# EAGLE design driver (EAGLE 6.4)

## Sheet 1 of 2
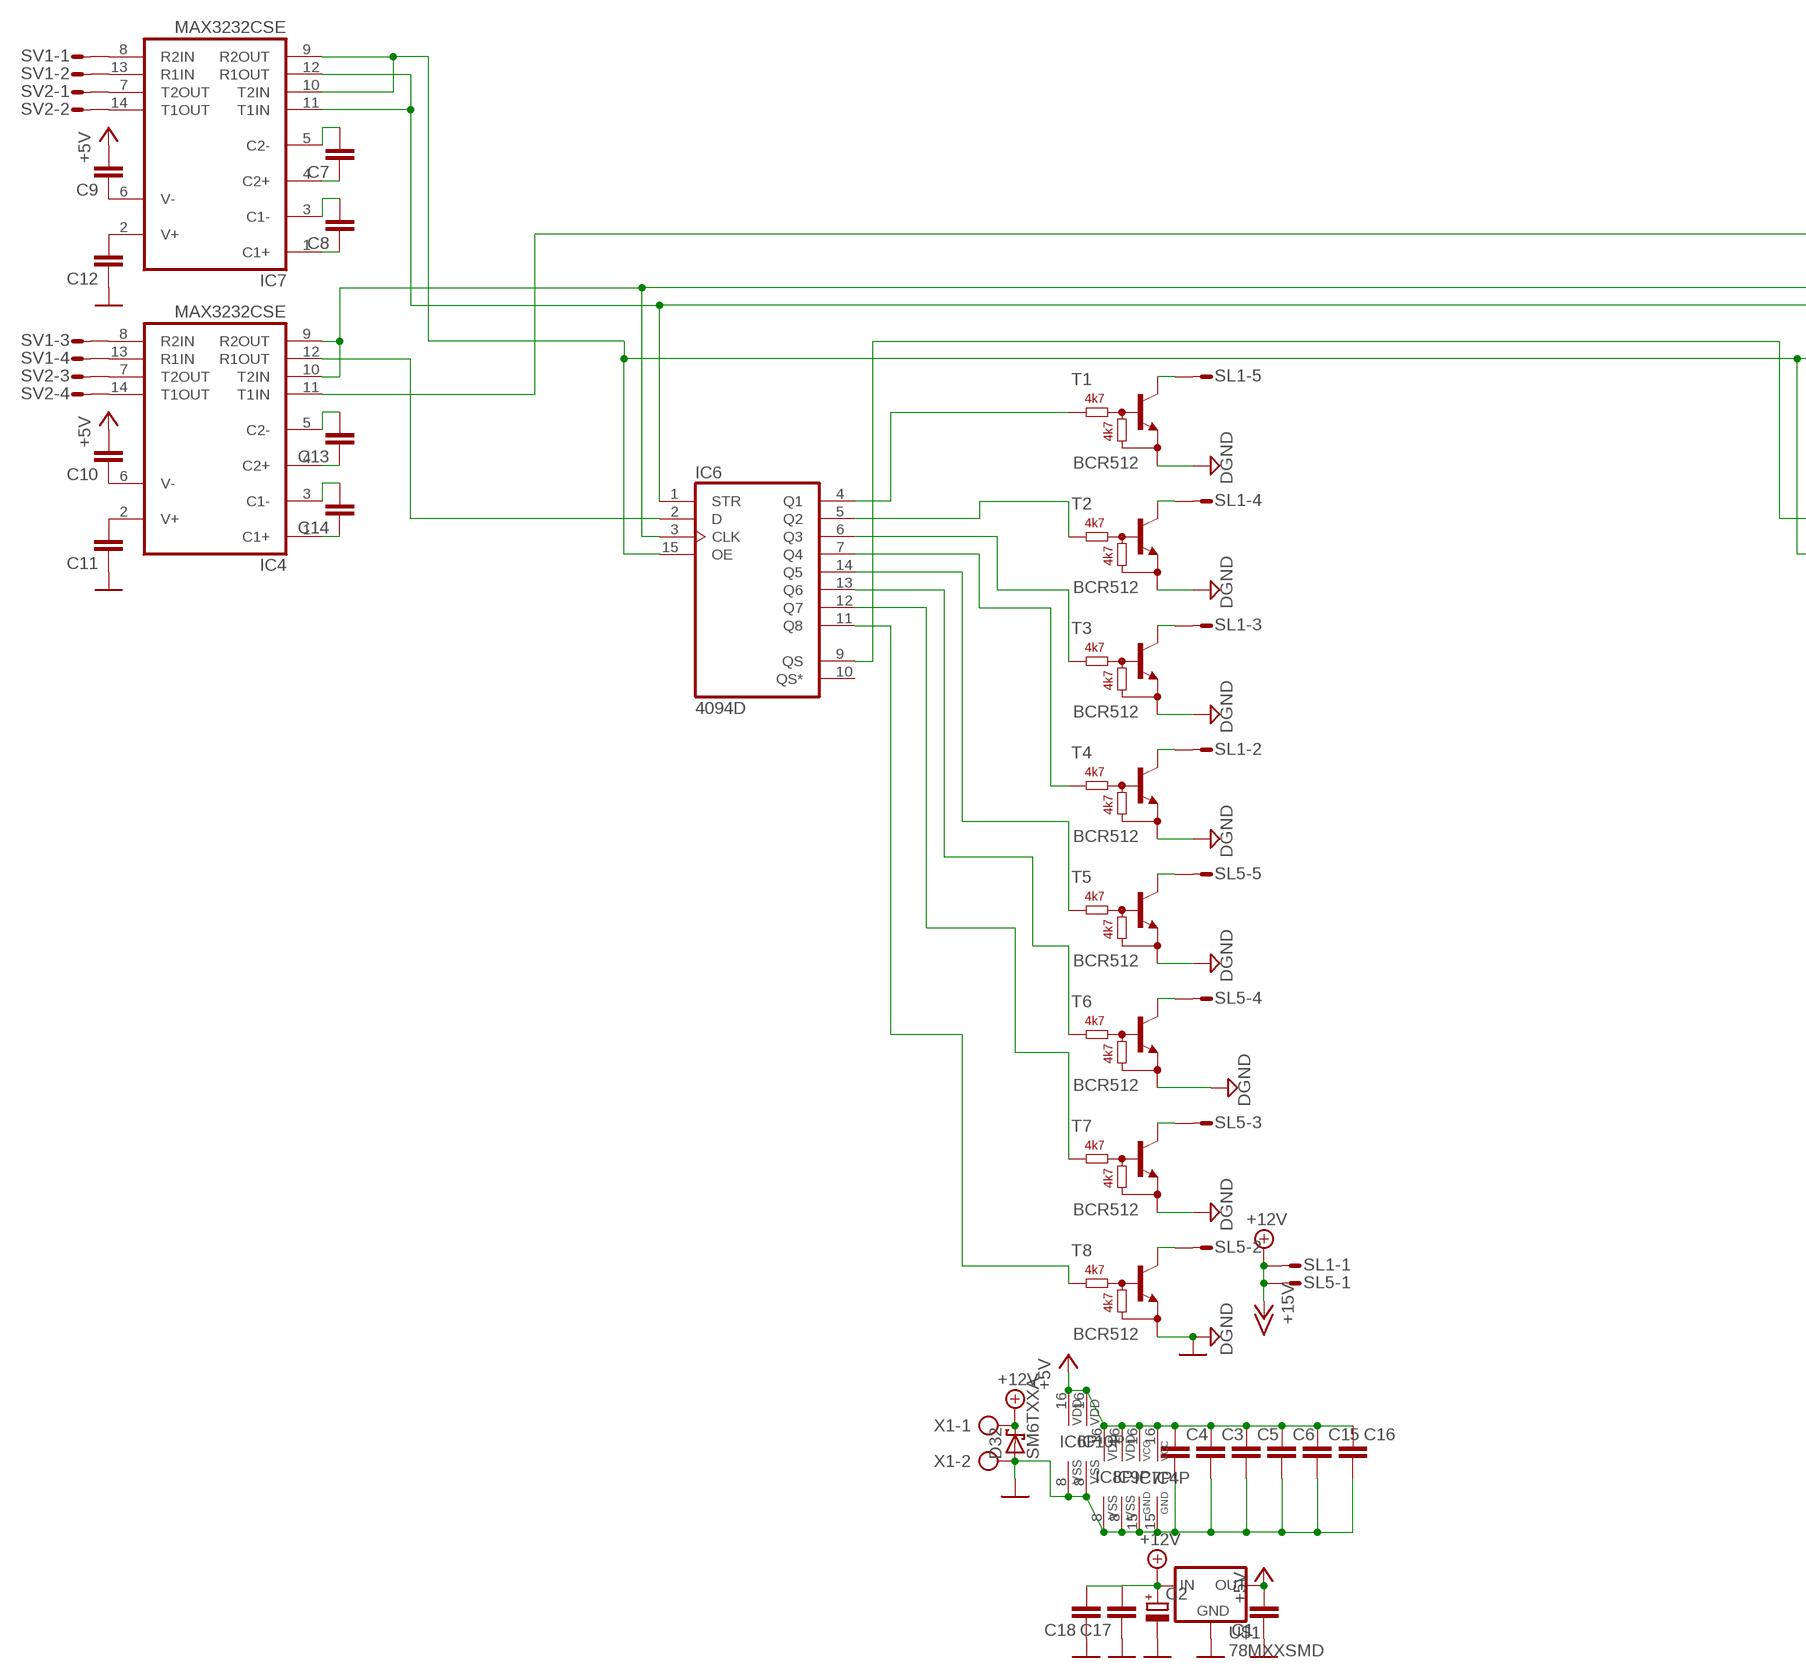
[diagram p0: schematic, sheet 1, part 1 of 2]
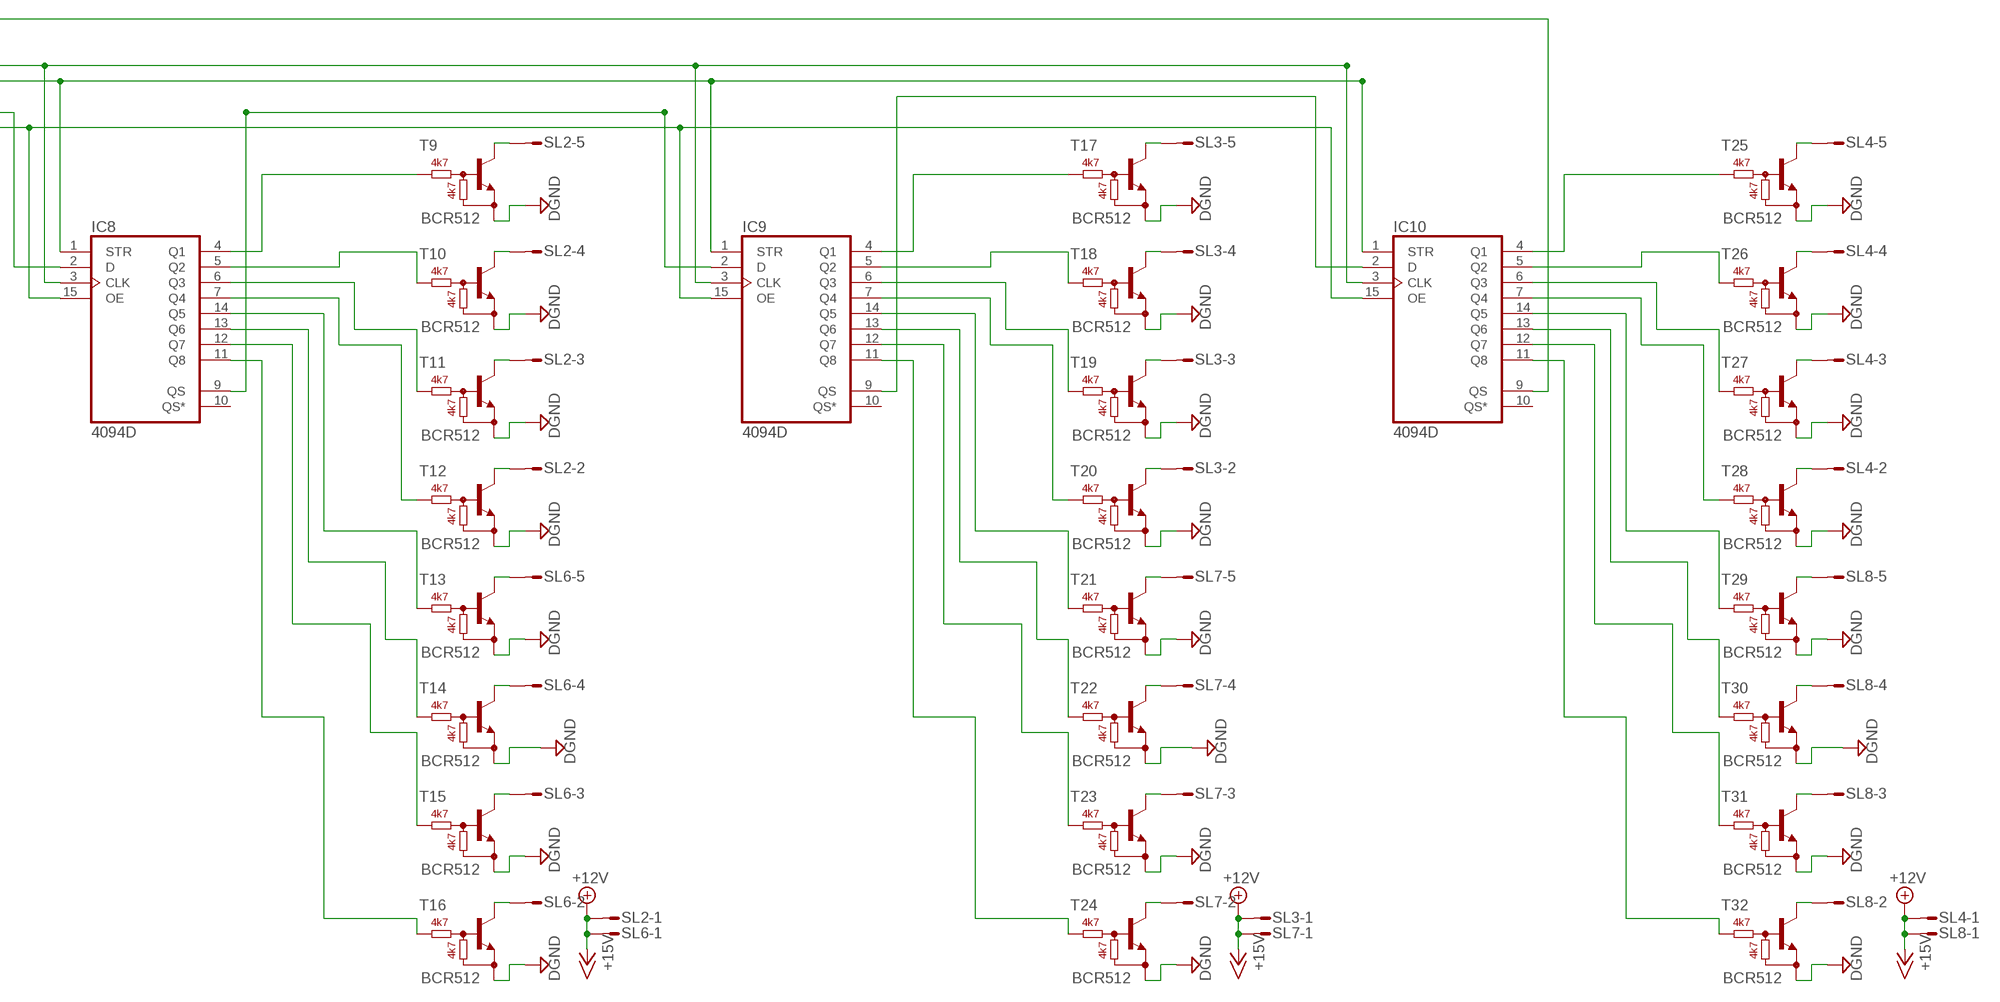
[diagram p1: schematic, sheet 1, part 2 of 2]

### Parts
C1  C-EUC0603  [C0603]
C2  CPOL-EUSMCD  [SMC_D]
C3  C-EUC0603  [C0603]
C4  C-EUC0603  [C0603]
C5  C-EUC0603  [C0603]
C6  C-EUC0603  [C0603]
C7  C-EUC0603  [C0603]
C8  C-EUC0603  [C0603]
C9  C-EUC0603  [C0603]
C10  C-EUC0603  [C0603]
C11  C-EUC0603  [C0603]
C12  C-EUC0603  [C0603]
C13  C-EUC0603  [C0603]
C14  C-EUC0603  [C0603]
C15  C-EUC0603  [C0603]
C16  C-EUC0603  [C0603]
C17  C-EUC0603  [C0603]
C18  C-EUC0603  [C0603]
D32  SM6TXXA  [SMB]
IC4  MAX3232CSE  [SO16]
IC6  4094D  [SO16]
IC7  MAX3232CSE  [SO16]
IC8  4094D  [SO16]
IC9  4094D  [SO16]
IC10  4094D  [SO16]
SL1  M05S  [05P]
SL2  M05S  [05P]
SL3  M05S  [05P]
SL4  M05S  [05P]
SL5  M05S  [05P]
SL6  M05S  [05P]
SL7  M05S  [05P]
SL8  M05S  [05P]
SV1  S04P  [S04P]
SV2  S04P  [S04P]
T1  BCR512  [SOT23-R_INFINEON]
T2  BCR512  [SOT23-R_INFINEON]
T3  BCR512  [SOT23-R_INFINEON]
T4  BCR512  [SOT23-R_INFINEON]
T5  BCR512  [SOT23-R_INFINEON]
T6  BCR512  [SOT23-R_INFINEON]
T7  BCR512  [SOT23-R_INFINEON]
T8  BCR512  [SOT23-R_INFINEON]
T9  BCR512  [SOT23-R_INFINEON]
T10  BCR512  [SOT23-R_INFINEON]
T11  BCR512  [SOT23-R_INFINEON]
T12  BCR512  [SOT23-R_INFINEON]
T13  BCR512  [SOT23-R_INFINEON]
T14  BCR512  [SOT23-R_INFINEON]
T15  BCR512  [SOT23-R_INFINEON]
T16  BCR512  [SOT23-R_INFINEON]
T17  BCR512  [SOT23-R_INFINEON]
T18  BCR512  [SOT23-R_INFINEON]
T19  BCR512  [SOT23-R_INFINEON]
T20  BCR512  [SOT23-R_INFINEON]
T21  BCR512  [SOT23-R_INFINEON]
T22  BCR512  [SOT23-R_INFINEON]
T23  BCR512  [SOT23-R_INFINEON]
T24  BCR512  [SOT23-R_INFINEON]
T25  BCR512  [SOT23-R_INFINEON]
T26  BCR512  [SOT23-R_INFINEON]
T27  BCR512  [SOT23-R_INFINEON]
T28  BCR512  [SOT23-R_INFINEON]
T29  BCR512  [SOT23-R_INFINEON]
T30  BCR512  [SOT23-R_INFINEON]
T31  BCR512  [SOT23-R_INFINEON]
T32  BCR512  [SOT23-R_INFINEON]
U$1  78MXXSMD  [DPACK]
X1  AK500/2  [AK500/2]

### Nets
+5V: C1.2 C3.1 C4.1 C5.1 C6.1 C9.2 C10.2 C15.1 C16.1 IC4.16(VCC) IC6.16(VDD) IC7.16(VCC) IC8.16(VDD) IC9.16(VDD) IC10.16(VDD) U$1.3(OUT)
+12V: C2.+ C17.2 C18.2 D32.C SL1.1 SL2.1 SL3.1 SL4.1 SL5.1 SL6.1 SL7.1 SL8.1 U$1.1(IN) X1.1 ; supply symbol labelled +15V
GND: C1.1 C2.- C3.2 C4.2 C5.2 C6.2 C11.1 C12.1 C15.2 C16.2 C17.1 C18.1 D32.A IC4.15(GND) IC6.8(VSS) IC7.15(GND) IC8.8(VSS) IC9.8(VSS) IC10.8(VSS) T1.2(E) T2.2(E) T3.2(E) T4.2(E) T5.2(E) T6.2(E) T7.2(E) T8.2(E) T9.2(E) T10.2(E) T11.2(E) T12.2(E) T13.2(E) T14.2(E) T15.2(E) T16.2(E) T17.2(E) T18.2(E) T19.2(E) T20.2(E) T21.2(E) T22.2(E) T23.2(E) T24.2(E) T25.2(E) T26.2(E) T27.2(E) T28.2(E) T29.2(E) T30.2(E) T31.2(E) T32.2(E) U$1.4(GND) X1.2 ; supply symbol labelled DGND
N$1: IC8.13(Q6) T14.1(B)
N$2: IC8.4(Q1) T9.1(B)
N$3: IC8.5(Q2) T10.1(B)
N$4: IC8.11(Q8) T16.1(B)
N$5: IC8.12(Q7) T15.1(B)
N$6: IC8.14(Q5) T13.1(B)
N$7: IC8.7(Q4) T12.1(B)
N$8: IC8.6(Q3) T11.1(B)
N$9: SL2.5 T9.3(C)
N$10: SL2.4 T10.3(C)
N$11: IC6.12(Q7) T7.1(B)
N$12: SL6.5 T13.3(C)
N$13: SL6.4 T14.3(C)
N$14: SL6.3 T15.3(C)
N$15: SL6.2 T16.3(C)
N$16: SL2.2 T12.3(C)
N$17: SL2.3 T11.3(C)
N$18: IC9.9(QS) IC10.2(D)
N$19: IC10.13(Q6) T30.1(B)
N$20: IC10.4(Q1) T25.1(B)
N$21: IC8.9(QS) IC9.2(D)
N$22: IC4.11(T1IN) IC10.9(QS)
N$23: IC9.13(Q6) T22.1(B)
N$24: IC7.8(R2IN) SV1.1
N$25: IC9.4(Q1) T17.1(B)
N$29: C7.1 IC7.4(C2+)
N$37: IC9.5(Q2) T18.1(B)
N$38: IC9.11(Q8) T24.1(B)
N$39: IC9.12(Q7) T23.1(B)
N$40: IC9.14(Q5) T21.1(B)
N$41: IC9.7(Q4) T20.1(B)
N$42: IC9.6(Q3) T19.1(B)
N$43: SL3.5 T17.3(C)
N$44: SL3.4 T18.3(C)
N$45: SL7.5 T21.3(C)
N$46: SL7.4 T22.3(C)
N$47: SL7.3 T23.3(C)
N$48: SL7.2 T24.3(C)
N$49: SL3.2 T20.3(C)
N$50: SL3.3 T19.3(C)
N$58: IC6.1(STR) IC7.11(T1IN) IC7.12(R1OUT) IC8.1(STR) IC9.1(STR) IC10.1(STR)
N$59: IC4.12(R1OUT) IC6.2(D)
N$62: IC10.5(Q2) T26.1(B)
N$63: IC10.11(Q8) T32.1(B)
N$64: IC10.12(Q7) T31.1(B)
N$65: IC10.14(Q5) T29.1(B)
N$66: IC10.7(Q4) T28.1(B)
N$67: IC7.13(R1IN) SV1.2
N$68: IC10.6(Q3) T27.1(B)
N$69: SL4.5 T25.3(C)
N$70: SL4.4 T26.3(C)
N$71: SL8.5 T29.3(C)
N$76: IC4.8(R2IN) SV1.3
N$77: SL8.4 T30.3(C)
N$78: SL8.3 T31.3(C)
N$79: SL8.2 T32.3(C)
N$80: SL4.2 T28.3(C)
N$81: SL4.3 T27.3(C)
N$82: IC6.15(OE) IC7.9(R2OUT) IC7.10(T2IN) IC8.15(OE) IC9.15(OE) IC10.15(OE)
N$84: IC6.14(Q5) T5.1(B)
N$85: IC4.9(R2OUT) IC4.10(T2IN) IC6.3(CLK) IC8.3(CLK) IC9.3(CLK) IC10.3(CLK)
N$92: IC4.13(R1IN) SV1.4
N$93: IC6.7(Q4) T4.1(B)
N$94: IC7.7(T2OUT) SV2.1
N$100: C8.1 IC7.1(C1+)
N$110: IC6.6(Q3) T3.1(B)
N$111: SL1.5 T1.3(C)
N$112: SL1.4 T2.3(C)
N$123: SL5.5 T5.3(C)
N$124: SL5.4 T6.3(C)
N$125: SL5.3 T7.3(C)
N$126: SL5.2 T8.3(C)
N$127: IC6.13(Q6) T6.1(B)
N$128: IC6.4(Q1) T1.1(B)
N$129: IC6.5(Q2) T2.1(B)
N$130: SL1.2 T4.3(C)
N$131: SL1.3 T3.3(C)
N$136: IC7.14(T1OUT) SV2.2
N$137: IC4.7(T2OUT) SV2.3
N$141: IC6.9(QS) IC8.2(D)
N$143: IC4.14(T1OUT) SV2.4
N$153: IC6.11(Q8) T8.1(B)
N$160: C13.1 IC4.4(C2+)
N$161: C14.1 IC4.1(C1+)
N$167: C12.2 IC7.2(V+)
N$207: C9.1 IC7.6(V-)
N$208: C11.2 IC4.2(V+)
N$209: C10.1 IC4.6(V-)
N$210: C7.2 IC7.5(C2-)
N$211: C8.2 IC7.3(C1-)
N$212: C13.2 IC4.5(C2-)
N$213: C14.2 IC4.3(C1-)
Unconnected: IC6.10(QS*) IC8.10(QS*) IC9.10(QS*) IC10.10(QS*)

## Sheet 2 of 2

## Library data of the parts
C1 C3-C18 = rcl:C-EU: CAPACITOR, European symbol; OC_FARNELL: 1759122
C2 = rcl:CPOL-EU: POLARIZED CAPACITOR, European symbol; OC_FARNELL: 1135058
D32 = diode:SM6TXXA; OC_FARNELL: 9885900
IC4 IC7 = maxim:MAX3232*: True RS-232 Transceivers 3.0V to 5.5V, Low-Power up to 1Mbps, Using Four 0.1µF External Capacitors Source: http://pdfserv.maxim-ic.com/en/ds/MAX3222-MAX3241.pdf; OC_FARNELL: 1470443
IC6 IC8-IC10 = 40xx:4094: 8-stage SHIFT/STORE REGISTER, tri-state; OC_FARNELL: 1740132
SL1-SL8 = con-amp-quick:M05S: AMP QUICK CONNECTOR
SV1 SV2 = con-amp-mt:S04P: AMP MT CONNECTOR
T1-T32 = digital-transistors-1:BCR512: NPN Silicon Digital Transistor 50V 0,5A 0,33W; OC_FARNELL: 2317629
U$1 = v-reg:78MXXSMD; OC_FARNELL: 2296057
X1 = con-ptr500:AK500/2: CONNECTOR

## Board
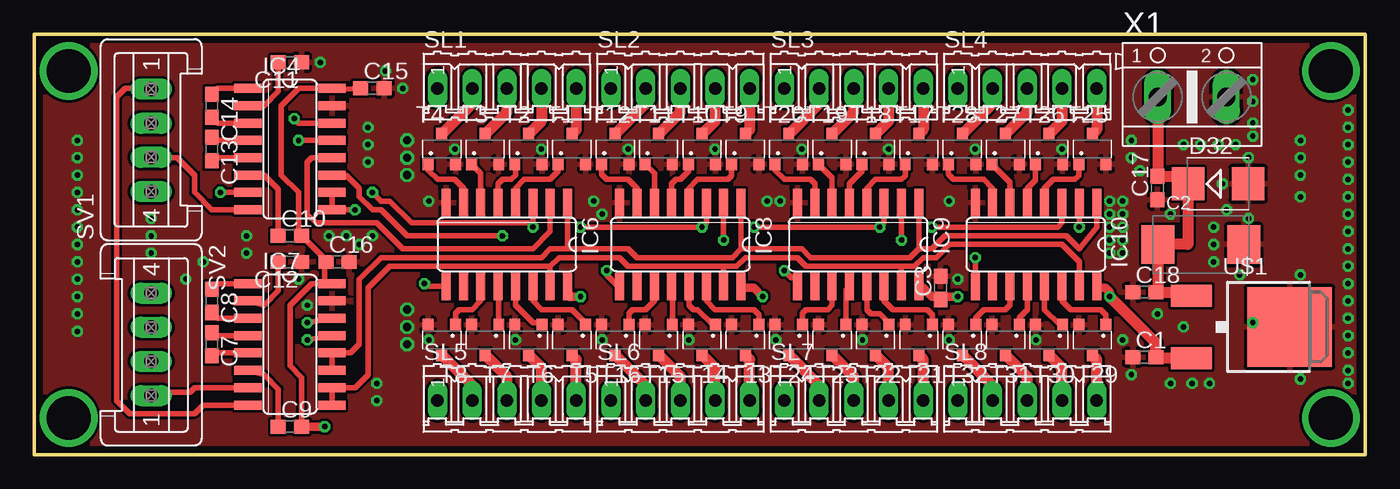
[diagram p2: board, top side]
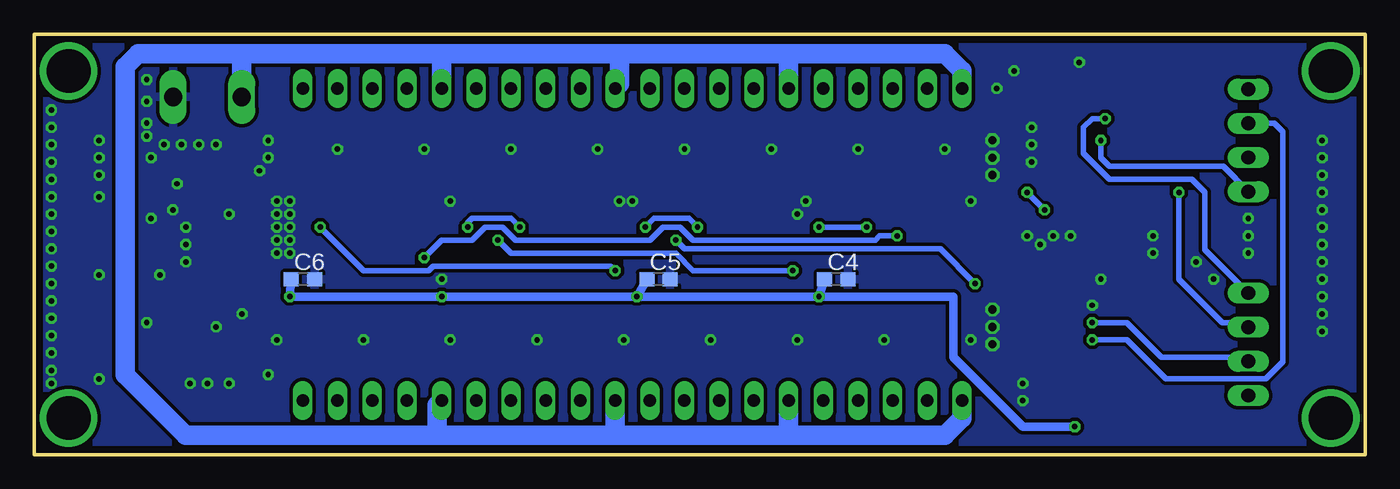
[diagram p3: board, bottom side, seen from below]

Size 97.45 x 30.79 mm. Coordinates in mm from the lower left corner, seen from the top.
Outline: 0,0 97.45,0 97.45,30.79 0,30.79 0,0
Copper layers (1*16): Top 0.035mm / dielectric 1.5mm / Bottom 0.035mm
Design rules "default *": minimum track width 10mil, minimum drill 0.4mm, track to track 8mil, track to pad 8mil, pad to pad 8mil, via to via 8mil, smd to smd 8mil, copper to edge 20mil, drill to drill 8mil, minimum pad ring 10mil, minimum via ring 8mil, stop-mask expansion 4mil, vias tented up to drill 0.4mm, thermal gap 10mil

### Footprints (pad centres in the part's own frame; a part is rotated, then mirrored left to right if it is on the bottom)
C0603 = smd 1.1 x 1: 1 -0.85,0; 2 0.85,0
SMC_D = smd 2.4 x 2.8: + -3.15,0; - 3.15,0
SMB = smd 2.4 x 2.4: A 2.2,0; C -2.2,0
SO16 = smd 0.66 x 2.032: 1 -4.445,-3.073; 2 -3.175,-3.073; 3 -1.905,-3.073; 4 -0.635,-3.073; 5 0.635,-3.073; 6 1.905,-3.073; 7 3.175,-3.073; 8 4.445,-3.073; 9 4.445,3.073; 10 3.175,3.073; 11 1.905,3.073; 12 0.635,3.073; 13 -0.635,3.073; 14 -1.905,3.073; 15 -3.175,3.073; 16 -4.445,3.073
05P = drill 0.914 long: 1 -5.08,0; 2 -2.54,0; 3 0,0; 4 2.54,0; 5 5.08,0
S04P = drill 1.016 long: 1 3.75,0; 2 1.25,0; 3 -1.25,0; 4 -3.75,0
SOT23-R_INFINEON = smd 0.8 x 0.9: 1 -1,-1.1; 2 1,-1.1; 3 0,1.1
DPACK = smd 1.6 x 3: 1 -2.28,-4.8; 3 2.28,-4.8 | smd 5.8 x 6.2: 4 0,2.38
AK500/2 = drill 1.321 long: 1 -2.515,0; 2 2.515,0

### Placement (x,y rotation side)
C1  81.27,7.14 0 top
C2  85.4,15.39 0 top
C3  66.35,12.22 90 top
C4  38.73,12.85 0 bottom
C5  51.75,12.85 0 bottom
C6  77.78,12.85 0 bottom
C7  13.01,8.09 270 top
C8  13.01,11.27 270 top
C9  18.73,2.06 0 top
C10  18.73,16.03 0 top
C11  18.73,28.73 180 top
C12  18.73,14.12 180 top
C13  13.01,22.38 270 top
C14  13.01,25.55 270 top
C15  24.76,26.82 0 top
C16  22.22,14.12 0 top
C17  82.23,19.52 90 top
C18  81.27,11.9 0 top
D32  86.67,19.84 0 top
IC4  18.73,22.38 270 top
IC6  34.6,15.39 180 top
IC7  18.73,8.09 270 top
IC8  47.3,15.39 180 top
IC9  60.32,15.39 180 top
IC10  73.34,15.39 180 top
SL1  34.6,26.82 0 top
SL2  47.3,26.82 0 top
SL3  60,26.82 0 top
SL4  72.7,26.82 0 top
SL5  34.6,3.96 0 top
SL6  47.3,3.96 0 top
SL7  60,3.96 0 top
SL8  72.7,3.96 0 top
SV1  8.57,23.01 90 top
SV2  8.57,8.09 270 top
T1  39.37,22.38 0 top
T2  36.19,22.38 0 top
T3  33.02,22.38 0 top
T4  29.84,22.38 0 top
T5  39.37,8.41 180 top
T6  36.19,8.41 180 top
T7  33.02,8.41 180 top
T8  29.84,8.41 180 top
T9  52.06,22.38 0 top
T10  48.89,22.38 0 top
T11  45.72,22.38 0 top
T12  42.54,22.38 0 top
T13  52.06,8.41 180 top
T14  48.89,8.41 180 top
T15  45.72,8.41 180 top
T16  42.54,8.41 180 top
T17  64.77,22.38 0 top
T18  61.59,22.38 0 top
T19  58.41,22.38 0 top
T20  55.24,22.38 0 top
T21  64.77,8.41 180 top
T22  61.59,8.41 180 top
T23  58.41,8.41 180 top
T24  55.24,8.41 180 top
T25  77.46,22.38 0 top
T26  74.29,22.38 0 top
T27  71.11,22.38 0 top
T28  67.94,22.38 0 top
T29  77.46,8.41 180 top
T30  74.29,8.41 180 top
T31  71.11,8.41 180 top
T32  67.94,8.41 180 top
U$1  89.53,9.36 270 top
X1  84.77,26.19 0 top

### Tracks (layer width: path | path; a pad name or v marks a point on that pad's centre or on a via)
+5V  (via drill 0.4)
  Top 0.406: C15.1 22.01,26.71 IC4.16 19.36,26.82 18.09,25.55 18.09,20.47 19.36,19.2 19.36,16.24 C10.2 21.37,14.23 C16.1 21.27,14.02 21.27,12.54 | C9.2 19.58,5.65 18.73,6.5 18.73,10.95 20.32,12.54 21.27,12.54 | 21.27,12.54 IC7.16
  Top 0.61: IC10.16 77.88,12.22 78.42,12.22 78.74,11.9 v78.74,11.58 | IC9.16 64.87,12.22 65.08,12.22 65.72,11.58 66.14,11.58 | IC8.16 51.85,12.22 52.7,12.22 v53.33,11.58 | IC6.16 39.15,11.58 v40,11.58 | C9.2 v21.27,2.06 | 66.14,11.58 C3.1 | v67.62,11.58 66.14,11.58
  Top 0.813: U$1.3 82.18,7.08 C1.2 82.13,8.19 v78.74,11.58
  Bottom 0.61: C6.1 v78.74,11.58 v67.62,11.58 v53.33,11.58 | v53.33,11.58 C5.1 | v40,11.58 v53.33,11.58 | v40,11.58 C4.1 | v40,11.58 30.16,11.58 30.16,7.14 25.08,2.06 v21.27,2.06
+12V
  Top 0.813: X1.1 82.25,20.4 C17.2 83.94,20.37 D32.C 84.47,15.41 84.45,15.39 C2.+ 82.25,12.03 C18.2 84.47,11.9 U$1.1
  Bottom 1.422: 54.61,29.36 42.54,29.36 | 42.54,29.36 30.79,29.36 29.52,28.09 SL1.1 | 67.62,29.36 54.61,29.36 | 54.61,29.36 54.61,27.14 SL3.1 | 67.62,29.36 SL4.1 | 42.22,1.42 30.79,1.42 29.52,2.69 SL5.1 | 42.22,1.42 54.92,1.42 | 54.92,1.42 67.94,1.42 | 67.94,1.42 86.35,1.42 90.8,5.87 90.8,28.41 89.85,29.36 81.91,29.36 | SL8.1 67.94,3.65 67.94,1.42 | 81.91,29.36 67.62,29.36 | SL6.1 42.22,1.42 | SL7.1 54.92,1.42 | SL2.1 42.22,29.04 42.54,29.36 | X1.1 82.25,29.02 81.91,29.36
GND  (via drill 0.4, 0.6)
  other vias: 24.44,22.7 23.81,15.39 40.95,18.57 53.65,18.57 66.99,18.57 25.08,5.23 25.08,3.96 24.44,21.43 67.62,12.85 79.69,18.57 78.73,18.57 78.73,17.61 78.73,16.66 78.73,15.71 78.73,14.76 79.69,17.61 79.69,16.66 79.69,15.71 79.69,14.76 15.55,14.76 11.11,12.85 8.57,14.76 8.57,16.03 8.57,17.3 12.38,14.12 15.55,16.03 21.59,16.03 22.86,16.03 20,10.95 24.76,16.03 24.44,23.96 3.17,23.01 3.17,20.47 3.17,19.2 3.17,21.74 3.17,17.93 3.17,15.39 3.17,14.12 3.17,16.66 3.17,12.85 3.17,10.31 3.17,9.04 3.17,11.58 89.21,27.46 89.21,24.28 89.21,23.33 89.21,25.87 92.7,23.01 92.7,20.47 92.7,18.89 92.7,21.74 96.2,21.43 96.2,23.96 96.2,25.23 96.2,22.7 27.3,23.01 27.3,21.74 27.3,20.47 27.3,8.09 27.3,9.36 27.3,10.63 20.95,28.73 19.36,12.85 25.71,28.09 26.98,26.82 28.89,18.57 54.61,18.57 83.18,5.23 41.59,17.61 84.77,5.23 84.13,9.36 80.96,20.79 83.18,17.61 80.32,21.74 89.21,9.68 88.89,17.3 80.32,23.01 86.04,5.23 43.49,22.38 30.79,22.38 37.14,22.38 49.84,22.38 62.54,22.38 68.89,22.38 56.19,22.38 75.24,22.38 41.59,8.41 28.89,8.41 35.24,8.41 47.94,8.41 60.64,8.41 66.99,8.41 54.29,8.41 73.34,8.41 96.2,20.16 96.2,17.61 96.2,16.34 96.2,18.89 96.2,15.07 96.2,12.54 96.2,11.27 96.2,13.8 96.2,9.99 96.2,7.46 96.2,6.18 96.2,8.72 96.2,5.23 80.32,5.87 79.69,8.41 82.23,10.31 86.35,16.66 86.35,15.39 86.35,14.12 88.26,13.17 92.7,13.17 92.7,5.55 88.89,21.74 84.13,22.7 85.4,22.7 86.67,22.7 87.94,22.7 86.99,19.84 87.31,17.93
  pour Top (rank 2): -5.4,50.95 -3.5,-6.2 100.64,-8.1 100.64,49.05
  pour Bottom (isolate 0.254, rank 2): -4.77,50.32 100.01,49.68 100.01,-8.74 -2.86,-8.1
  pour Top (isolate 0.254): 79.69,19.84 79.69,38.25 26.35,38.25 26.35,19.84
  pour Top (isolate 0.254): 98.1,-0.48 98.1,8.41 79.69,8.41 79.69,10.95 26.35,10.95 26.35,-0.48
  pour Bottom: 26.03,23.65 26.03,7.46 27.94,7.46 27.94,23.65
N$1
  Top 0.406: IC8.13 47.94,10.95 48.26,10.63 48.57,10.63 49.69,9.51 T14.1
N$2
  Top 0.406: IC8.4 47.94,19.52 48.57,20.16 50.8,20.16 51.06,20.43 T9.1
N$3
  Top 0.406: IC8.5 46.67,19.84 46.98,20.16 47.3,20.16 47.89,20.74 T10.1
N$4
  Top 0.406: IC8.11 45.4,11.27 44.76,10.63 43.81,10.63 43.54,10.36 T16.1
N$5
  Top 0.406: IC8.12 46.72,12.27 T15.1
N$6
  Top 0.406: IC8.14 49.21,11.27 49.84,10.63 52.7,10.63 53.06,10.27 T13.1
N$7
  Top 0.406: IC8.7 44.13,19.52 43.49,20.16 41.91,20.16 41.54,20.52 T12.1
N$8
  Top 0.406: T11.1 45.4,20.59 IC8.6
N$9
  Top 0.813: T9.3 52.38,23.79 SL2.5
N$10
  Top 0.813: T10.3 49.84,24.43 SL2.4
N$11
  Top 0.406: IC6.12 34.01,12.27 T7.1
N$12
  Top 0.813: T13.3 52.38,6.99 SL6.5
N$13
  Top 0.813: T14.3 49.84,6.35 SL6.4
N$14
  Top 0.813: T15.3 47.3,5.72 SL6.3
N$15
  Top 0.813: T16.3 44.76,5.09 SL6.2
N$16
  Top 0.813: T12.3 44.76,25.7 SL2.2
N$17
  Top 0.813: T11.3 47.3,25.07 SL2.3
N$18  (via drill 0.4)
  Top 0.406: v76.51,16.66 IC10.2 | v54.92,13.49 55.46,12.95 55.77,12.95 IC9.9
  Bottom 0.406: v76.51,16.66 73.34,13.49 68.57,13.49 68.26,13.8 55.24,13.8 v54.92,13.49
N$19
  Top 0.406: IC10.13 73.97,10.63 75.1,9.51 T30.1
N$20
  Top 0.406: IC10.4 73.97,19.52 74.61,20.16 76.19,20.16 76.46,20.43 T25.1
N$21  (via drill 0.4)
  Top 0.406: v63.49,15.71 IC9.2 | v41.91,13.49 41.91,13.17 42.76,12.32 IC8.9
  Bottom 0.406: v63.49,15.71 62.54,14.76 50.48,14.76 49.21,13.49 v41.91,13.49
N$22  (via drill 0.4)
  Top 0.406: v34.29,16.03 27.3,16.03 25.39,17.93 24.76,17.93 23.81,18.89 23.81,19.52 22.85,20.47 IC4.11 | v68.89,14.44 IC10.9
  Bottom 0.406: v34.29,16.03 35.55,16.03 35.87,15.71 49.21,15.71 50.16,16.66 51.43,16.66 52.38,15.71 62.23,15.71 63.18,16.66 64.45,16.66 65.4,15.71 67.62,15.71 v68.89,14.44
N$23
  Top 0.406: IC9.13 60.95,10.63 61.27,10.31 61.91,10.31 62.59,9.63 T22.1
N$24
  Top 0.406: SV1.1 8.51,26.82 6.66,26.82 6.03,26.19 6.03,3.96 6.98,3.01 11.74,3.01 12.38,3.65 IC7.8
N$25
  Top 0.406: IC9.4 60.95,19.52 61.59,20.16 63.49,20.16 63.77,20.43 T17.1
N$29
  Top 0.406: C7.1 12.91,8.72 IC7.4
N$37
  Top 0.406: IC9.5 59.69,19.84 60.59,20.74 T18.1
N$38
  Top 0.406: IC9.11 58.41,10.95 58.1,10.63 56.51,10.63 56.24,10.36 T24.1
N$39
  Top 0.406: IC9.12 59.41,12.05 T23.1
N$40
  Top 0.406: IC9.14 62.23,11.27 62.86,10.63 65.4,10.63 65.77,10.27 T21.1
N$41
  Top 0.406: IC9.7 57.15,19.84 56.83,20.16 54.92,20.16 54.24,20.84 T20.1
N$42
  Top 0.406: T19.1 58.41,20.28 IC9.6
N$43
  Top 0.813: T17.3 65.08,23.79 SL3.5
N$44
  Top 0.813: T18.3 62.54,24.43 SL3.4
N$45
  Top 0.813: T21.3 65.08,6.99 SL7.5
N$46
  Top 0.813: T22.3 62.54,6.35 SL7.4
N$47
  Top 0.813: T23.3 60,5.72 SL7.3
N$48
  Top 0.813: T24.3 57.46,5.09 SL7.2
N$49
  Top 0.813: T20.3 57.46,25.7 SL3.2
N$50
  Top 0.813: T19.3 60,25.07 SL3.3
N$52  (via drill 3.2 pad 3.81)
  other vias: 94.93,28.09
N$53  (via drill 3.2 pad 3.81)
  other vias: 94.93,2.69
N$58
  Top 0.406: IC10.1 77.78,16.66 76.51,15.07 75.56,16.03 66.67,16.03 65.72,15.07 64.77,15.07 | 39.05,15.07 43.49,15.07 44.13,14.44 51.11,14.44 51.75,15.07 | 51.75,15.07 56.19,15.07 56.83,14.44 64.13,14.44 64.77,15.07 | 39.05,15.07 IC6.1 | 51.75,15.07 IC8.1 | 64.77,15.07 IC9.1 | IC7.11 IC7.12 23.17,7.46 23.81,8.09 23.81,12.85 25.39,14.44 37.14,14.44 37.78,15.07 39.05,15.07
N$59
  Top 0.406: IC6.2 37.78,16.34 36.51,15.07 26.98,15.07 25.08,16.98 20.63,16.98 20,17.61 20,21.43 20.32,21.74 IC4.12
N$62
  Top 0.406: IC10.5 72.7,19.52 73.29,20.11 T26.1
N$63
  Top 0.406: IC10.11 71.43,10.95 71.12,10.63 69.53,10.63 68.94,10.04 T32.1
N$64
  Top 0.406: IC10.12 72.7,10.63 72.12,10.04 T31.1
N$65
  Top 0.406: IC10.14 75.24,11.27 75.88,10.63 78.1,10.63 78.46,10.27 T29.1
N$66
  Top 0.406: IC10.7 70.16,19.52 69.53,20.16 67.3,20.16 66.94,20.52 T28.1
N$67  (via drill 0.4)
  Top 0.406: v20,8.41 IC7.13
  Bottom 0.406: SV1.2 7.91,24.28 6.66,24.28 6.03,23.65 6.03,6.82 7.3,5.55 14.6,5.55 17.46,8.41 v20,8.41
N$68
  Top 0.406: T27.1 71.43,19.96 IC10.6
N$69
  Top 0.813: T25.3 77.78,23.79 SL4.5
N$70
  Top 0.813: T26.3 75.24,24.43 SL4.4
N$71
  Top 0.813: T29.3 77.78,6.99 SL8.5
N$76
  Top 0.406: SV1.3 9.22,21.74 10.47,21.74 11.74,20.47 11.74,19.2 13.01,17.93 IC4.8
N$77
  Top 0.813: T30.3 75.24,6.35 SL8.4
N$78
  Top 0.813: T31.3 72.7,5.72 SL8.3
N$79
  Top 0.813: T32.3 70.16,5.09 SL8.2
N$80
  Top 0.813: T28.3 70.16,25.7 SL4.2
N$81
  Top 0.813: T27.3 72.7,25.07 SL4.3
N$82
  Top 0.406: IC10.15 76.51,14.12 75.24,15.39 66.99,15.39 66.04,14.44 65.08,14.44 64.45,13.8 63.49,13.8 | 37.78,13.8 26.03,13.8 24.44,12.22 24.44,5.87 23.49,4.92 IC7.10 IC7.9 | 37.78,13.8 38.41,14.44 42.86,14.44 43.49,13.8 50.48,13.8 | 50.48,13.8 51.43,13.8 52.06,14.44 55.87,14.44 56.51,13.8 63.49,13.8 | 37.78,13.8 IC6.15 | 50.48,13.8 IC8.15 | 63.49,13.8 IC9.15
N$84
  Top 0.406: IC6.14 36.51,11.27 37.14,10.63 39.37,10.63 40.37,9.63 T5.1
N$85  (via drill 0.4)
  Top 0.406: IC10.3 75.24,16.98 74.93,16.66 v65.72,16.66 | IC9.3 62.23,16.98 v61.91,16.66 v52.7,16.66 | IC8.3 49.21,16.98 v48.89,16.66 v40,16.66 | IC6.3 v36.51,16.66 36.19,16.98 27.62,16.98 26.03,18.57 25.39,18.57 v24.76,19.2 | IC4.10 IC4.9 v23.49,17.93
  Bottom 0.406: v48.89,16.66 49.52,17.3 52.06,17.3 v52.7,16.66 | v36.51,16.66 v40,16.66 | v61.91,16.66 62.54,17.3 65.4,17.3 65.72,16.98 v65.72,16.66 | v23.49,17.93 v24.76,19.2
N$92  (via drill 0.4)
  Top 0.406: v19.36,23.01 IC4.13
  Bottom 0.406: SV1.4 10.41,21.11 18.73,21.11 19.36,21.74 v19.36,23.01
N$93
  Top 0.406: IC6.7 31.43,19.52 30.79,20.16 29.52,20.16 28.84,20.84 T4.1
N$94
  Top 0.406: SV2.1 8.63,4.6 11.42,4.6 11.74,4.92 IC7.7
N$100
  Top 0.406: C8.1 13.43,12.54 IC7.1
N$110
  Top 0.406: T3.1 32.7,20.59 IC6.6
N$111
  Top 0.813: T1.3 39.68,23.79 SL1.5
N$112
  Top 0.813: T2.3 37.14,24.43 SL1.4
N$121  (via drill 3.2)
  other vias: 2.54,28.09
N$122  (via drill 3.2)
  other vias: 2.54,2.69
N$123
  Top 0.813: T5.3 39.68,6.99 SL5.5
N$124
  Top 0.813: T6.3 37.14,6.35 SL5.4
N$125
  Top 0.813: T7.3 34.6,5.72 SL5.3
N$126
  Top 0.813: T8.3 32.06,5.09 SL5.2
N$127
  Top 0.406: IC6.13 35.24,10.95 36.51,9.68 37.02,9.68 T6.1
N$128
  Top 0.406: IC6.4 35.24,19.52 35.87,20.16 37.78,20.16 38.37,20.74 T1.1
N$129
  Top 0.406: T2.1 35.24,21.23 35.24,20.47 34.92,20.16 34.29,20.16 33.97,19.84 IC6.5
N$130
  Top 0.813: T4.3 32.06,25.7 SL1.2
N$131
  Top 0.813: T3.3 34.6,25.07 SL1.3
N$136  (via drill 0.4)
  Top 0.406: v20,9.68 IC7.14
  Bottom 0.406: SV2.2 8.59,7.14 14.92,7.14 17.46,9.68 v20,9.68
N$137  (via drill 0.4)
  Top 0.406: v13.65,19.2 IC4.7
  Bottom 0.406: SV2.3 8.59,9.68 10.47,9.68 13.65,12.85 v13.65,19.2
N$141  (via drill 0.4)
  Top 0.406: v50.48,15.71 IC8.2 | v28.57,12.54 28.79,12.32 IC6.9
  Bottom 0.406: v50.48,15.71 49.84,15.07 31.11,15.07 v28.57,12.54
N$143  (via drill 0.4)
  Top 0.406: v19.05,24.6 19.36,24.28 IC4.14
  Bottom 0.406: SV2.4 11.74,15.02 11.74,19.2 12.69,20.16 18.73,20.16 20.63,22.06 20.63,23.96 20,24.6 v19.05,24.6
N$153
  Top 0.406: IC6.11 32.7,11.27 32.06,10.63 31.11,10.63 30.84,10.36 T8.1
N$160
  Top 0.406: C13.1 13.23,23.01 IC4.4
N$161
  Top 0.406: C14.1 13.43,26.82 IC4.1
N$167
  Top 0.406: IC7.2 16.82,10.95 17.88,12 C12.2
N$207
  Top 0.406: IC7.6 16.82,5.87 17.88,4.81 C9.1
N$208
  Top 0.406: IC4.2 16.82,25.55 17.88,26.61 C11.2
N$209
  Top 0.406: IC4.6 16.82,20.47 17.88,19.42 C10.1
N$210
  Top 0.406: C7.2 13.23,7.46 IC7.5
N$211
  Top 0.406: C8.2 13.43,9.99 IC7.3
N$212
  Top 0.406: C13.2 13.23,21.74 IC4.5
N$213
  Top 0.406: C14.2 13.43,24.28 IC4.3

### Text on the board
popis: + | 4 | 3 | 2 | 1 | + | 4 | 3 | 2 | 1 | + | 4 | 3 | 2 | 1 | + | 4 | 3 | 2 | 1 | OE | GND | STB | IN | CLK | + | DTA | DTA | CLK | OUT | STB | OE | + | 8 | 7 | 6 | 5 | 8 | 7 | 6 | 5 | 8 | 7 | 6 | 5 | 8 | 7 | 6 | 5 | + | + | +